# Altium schematic sheet PART6_Step_Up_PSU.SchDoc
size A4
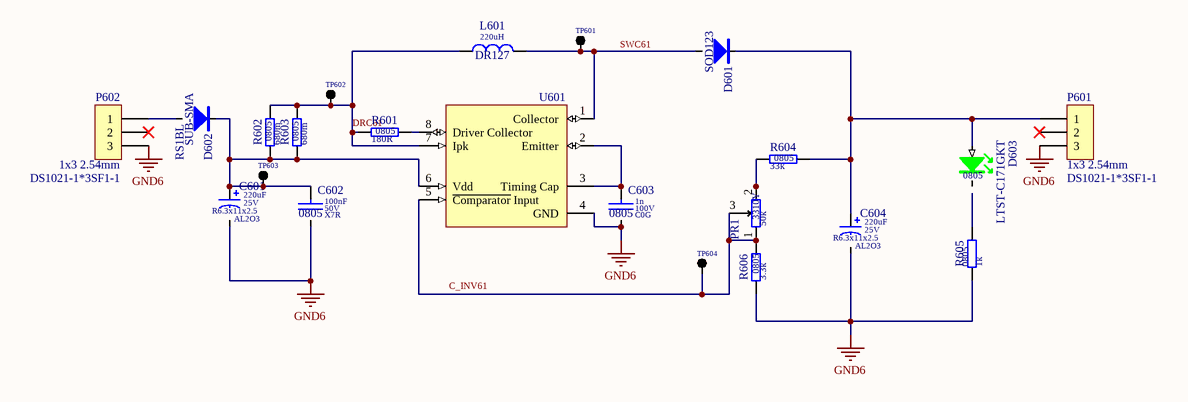
[diagram p0: PART6_Step_Up_PSU.SchDoc]

## Parts
C601  value 220uF  Dielectric: AL2O3  SCH_Footprint: R6.3x11x2.5  Voltage: 25V  [C_R6.3x11x2.5]  (hidden comment: Electrolytic Capacitor)
C602  value 100nF  Dielectric: X7R  Voltage: 50V  SCH_Footprint: 0805  [C_0805_2012]  (hidden comment: Ceramic X7R)
C603  value 1n  Dielectric: C0G  Voltage: 100V  SCH_Footprint: 0805  [C_0805_2012]  (hidden comment: Ceramic C0G)
C604  value 220uF  Dielectric: AL2O3  SCH_Footprint: R6.3x11x2.5  Voltage: 25V  [C_R6.3x11x2.5]  (hidden comment: Electrolytic Capacitor)
D601  1N5819HW  [SOD123]  (value not drawn)
D602  value RS1BL  [SUB-SMA]  (hidden comment: RS1BL fast rectifier)
D603  value LTST-C171GKT  SCH_Footprint: 0805  [OL_0805_2012]  (hidden comment: Green led)
L601  value 220uH  SCH_Footprint: DR127  [L_DR127]  (hidden comment: Inductor)
P601  value DS1021-1*3SF1-1  SCH_Footprint: 1x3 2.54mm  [P_HEADER_1x3_2.54]  (hidden comment: Goldpin)
P602  value DS1021-1*3SF1-1  SCH_Footprint: 1x3 2.54mm  [P_HEADER_1x3_2.54]  (hidden comment: Goldpin)
PR1  value 50k  [3310Y]  (hidden comment: Resistor)
R601  value 180R  SCH_Footprint: 0805  [R_0805_2012]  (hidden comment: Resistor)
R602  value 680m  SCH_Footprint: 0805  [R_0805_2012]  (hidden comment: Resistor)
R603  value 680m  SCH_Footprint: 0805  [R_0805_2012]  (hidden comment: Resistor)
R604  value 33k  SCH_Footprint: 0805  [R_0805_2012]  (hidden comment: Resistor)
R605  value 1k  SCH_Footprint: 0805  [R_0805_2012]  (hidden comment: Resistor)
R606  value 3.3k  SCH_Footprint: 0805  [R_0805_2012]  (hidden comment: Resistor)
TP601  Single pin  [TP_1PIN]  (value not drawn)
TP602  Single pin  [TP_1PIN]  (value not drawn)
TP603  Single pin  [TP_1PIN]  (value not drawn)
TP604  Single pin  [TP_1PIN]  (value not drawn)
U601  1.5-A Peak Boost/Buck/Inverting Switching Regulators  [SOP8_SO8_SOIC8_4X5X18]  (value not drawn)

## Nets
GND6: C601.2 C602.2 C603.2 C604.2 P601.3 P602.3 R605.1 R606.1 U601.4(GND)
DRC61: L601.1 R601.1 R602.2 R603.2 TP602.1(TP) U601.7(Ipk)
SWC61: D601.2 L601.2 TP601.1(TP) U601.1(Collector)
NetC601_1: C601.1 C602.1 D602.1 R602.1 R603.1 TP603.1(TP) U601.6(Vdd)
NetC603_1: C603.1 U601.2(Emitter) U601.3(Timing_Cap)
NetC604_1: C604.1 D601.1 D603.2(A) P601.1 R604.2
NetD602_2: D602.2 P602.1
NetPR1_1: PR1.1 PR1.3 R606.2 TP604.1(TP) U601.5(~{Comparator}_Input)
NetPR1_2: PR1.2 R604.1
NetR601_2: R601.2 U601.8(Driver_Collector)

Not connected (* = marked no-connect by the designer): D603 1(K); P601 2*; P602 2*; R605 2

## Notes on the sheet
- Labels drawn without touching a wire or pin: C_INV61

## Library data of the parts
C601 C604 = CE_220uF_25V_6.3x11x2.5_LESR_20: Polarized Capacitor; Manufacturer: Samxon; Manufacturer Part Number: GF 220U/25V; Tolerance (%): 20; Part Number: CE_220uF_25V_6.3x11x2.5_LESR_20; HelpURL: http://www.tme.eu/pl/Document/9fe41abe6e7b7973ea4089f212d099cc/E-GF_series.pdf; Supplier 1: TME; Supplier Part Number 1: GF220/25; Supplier 2: RS Components; Supplier 3: Farnell; Supplier 4: Mouser; Supplier 5: Digi-Key
C602 = C_100nF_50V_X7R_0805_10: Capacitor; Manufacturer: AVX; Manufacturer Part Number: 08055C104K4T2A; Tolerance (%): 10; Part Number: C_100nF_50V_X7R_0805_10; HelpURL: http://www.tme.eu/pl/Document/943bdb20b23b898c4d4b2ec4eca4f2b6/cauto.pdf; Supplier 1: TME; Supplier Part Number 1: 08055C104K4T2A; Supplier 2: RS Components; Supplier 3: Farnell; Supplier 4: Mouser; Supplier 5: Digi-Key
C603 = C_1nF_100V_C0G_0805_5: Capacitor; Manufacturer: Walsin; Manufacturer Part Number: 0805N102J101CT; Tolerance (%): 5; Part Number: C_1nF_100V_C0G_0805_5; HelpURL: https://datasheet.octopart.com/0805N102J101CT-Walsin-Technologies-datasheet-48038160.pdf; Supplier 1: TME; Supplier Part Number 1: 0805N102J101CT; Supplier 2: RS Components; Supplier 3: Farnell; Supplier Part Number 3: 2497011; Supplier 4: Mouser; Supplier Part Number 4: 791-0805N102J101CT; Supplier 5: Digi-Key
D601 = D_1N5819HW_1A_40V_SOD123: Voltage: 40V; Current: 1A; SCH_Footprint: SOD123; Part Number: D_1N5819HW_1A_40V_SOD123; Supplier 1: TME; Supplier 2: RS Components; Supplier 3: Farnell; Supplier 4: Mouser; Supplier 5: Digi-Key
D602 = D_RS1BL_100V_1A_SUB-SMA: Manufacturer: Taiwan Semiconductor; Voltage: 100V; Current: 1A; SCH_Footprint: SUB-SMA; Part Number: D_RS1BL_100V_1A_SUB-SMA; HelpURL: http://www.mouser.com/ds/2/395/RS1AL%20SERIES_K14-523620.pdf; Manufacturer Part Number: RS1BL; Supplier 1: TME; Supplier 2: RS Components; Supplier 3: Farnell; Supplier 4: Mouser; Supplier 5: Digi-Key
D603 = OL_G_0805_0C006_LTST-C171GKT: LED GREEN; Manufacturer: Lite-On; Part Number: OL_G_0805_0C006_LTST-C171GKT; HelpURL: http://datasheet.octopart.com/LTST-C171GKT-Lite-On-datasheet-158474.pdf; Manufacturer Part Number: LTST-C171GKT; Supplier 1: TME; Supplier Part Number 1: LTST-C171GKT; Supplier 2: RS Components; Supplier Part Number 2: 6920935; Supplier 3: Farnell; Supplier 4: Mouser; Supplier Part Number 4: 859-LTST-C171GKT; Supplier 5: Digi-Key; Supplier Part Number 5: 160-1423-1-ND
L601 = L_220uH_1.29A_DR127: Induction; Manufacturer: Eaton; Manufacturer Part Number: DR127-221-R; Current: 1.29A; Resistance: 376mR; Part Number: L_220uH_1.29A_DR127; HelpURL: https://datasheet.octopart.com/DR127-221-R-Eaton-datasheet-552538.pdf; Supplier 1: TME; Supplier 2: RS Components; Supplier Part Number 2: 7701028; Supplier 3: Farnell; Supplier Part Number 3: 2369123; Supplier 4: Mouser; Supplier Part Number 4: 704-DR127-221-R; Supplier 5: Digi-Key; Supplier Part Number 5: 513-1045-1-ND
P601 P602 = P_HEADER_1x3_2.54: Pin Header; Manufacturer: Connfly; Part Number: P_HEADER_1x3_2.54; Component Type: Standard; HelpURL: http://www.tme.eu/en/Document/cc301e58a5da78cb543a94b5a5b7f06a/DS1021.pdf; Manufacturer Part Number: DS1021-1*3SF1-1; Supplier 1: TME; Supplier Part Number 1: ZL201-03G; Supplier 2: RS Components; Supplier 3: Farnell; Supplier 4: Mouser; Supplier 5: Digi-Key
PR1 = R_50k_3310Y_20: Manufacturer: Bourns; Manufacturer Part Number: 3310Y-001-503L; Voltage: 50V; Power: 250mW; Tolerance: 20%; SCH_Footprint: 3310Y; Part Number: R_50k_3310Y_20; HelpURL: https://docs.rs-online.com/4641/0900766b8069b9f0.pdf; Supplier 1: TME; Supplier Part Number 1: 3310Y-001-503L; Supplier 2: RS Components; Supplier Part Number 2: 522-0697; Supplier 3: Farnell; Supplier Part Number 3: 9354000; Supplier 4: Mouser; Supplier 5: Digi-Key; Supplier Part Number 5: 3310Y-001-503L-ND
R601 = R_180R_0805_1: Manufacturer: Royalohm; Manufacturer Part Number: 0805S8F1800T5E; Voltage: 150V; Power: 125mW; Tolerance: 1%; Part Number: R_180R_0805_1; HelpURL: https://www.tme.eu/pl/Document/b315665a56acbc42df513c99b390ad98/ROYALOHM-THICKFILM.pdf; Supplier 1: TME; Supplier Part Number 1: SMD0805-180R-1%; Supplier 2: RS Components; Supplier 3: Farnell; Supplier 4: Mouser; Supplier 5: Digi-Key
R602 R603 = R_680m_0805_5: Manufacturer: Viking; Manufacturer Part Number: CS05JTFVR680; Voltage: 100V; Power: 250mW; Tolerance: 5%; Part Number: R_680m_0805_5; HelpURL: https://datasheet.octopart.com/CS05JTFVR680-Viking-datasheet-81455976.pdf; Supplier 1: TME; Supplier Part Number 1: CS0805-0R68-5%-HP; Supplier 2: RS Components; Supplier 3: Farnell; Supplier 4: Mouser; Supplier 5: Digi-Key
R604 = R_33k_0805_1: Manufacturer: Royalohm; Manufacturer Part Number: HP05W3F3302T5E; Voltage: 150V; Power: 300mW; Tolerance: 1%; Part Number: R_33k_0805_1; HelpURL: https://www.tme.eu/pl/Document/fa390a0a31e891a154d3713216995c6e/HighPowerHP.pdf; Supplier 1: TME; Supplier Part Number 1: HP05-33K1%; Supplier 2: RS Components; Supplier 3: Farnell; Supplier 4: Mouser; Supplier 5: Digi-Key
R605 = R_1k_0805_1: Manufacturer: Royalohm; Manufacturer Part Number: HP05W3F1001T5E; Voltage: 150V; Power: 300mW; Tolerance: 1%; Part Number: R_1k_0805_1; HelpURL: https://www.tme.eu/pl/Document/63d5a2fbb689d2d511047d7cc8640cd8/chip_resistor_hp.pdf; Supplier 1: TME; Supplier Part Number 1: HP05-1K1%; Supplier 2: RS Components; Supplier 3: Farnell; Supplier 4: Mouser; Supplier 5: Digi-Key
R606 = R_3.3k_0805_1: Manufacturer: Royalohm; Manufacturer Part Number: HP05W3F3301T5E; Voltage: 150V; Power: 300mW; Tolerance: 1%; Part Number: R_3.3k_0805_1; HelpURL: https://www.tme.eu/pl/Document/fa390a0a31e891a154d3713216995c6e/HighPowerHP.pdf; Supplier 1: TME; Supplier Part Number 1: HP05-3K31%; Supplier 2: RS Components; Supplier 3: Farnell; Supplier 4: Mouser; Supplier Part Number 4: 603-RC0805FR-073K3L; Supplier 5: Digi-Key; Supplier Part Number 5: 311-3.30KCRCT-ND
TP601-TP604 = TP_1PIN: Testpoint; SCH_Footprint: Single; Part Number: TP_1PIN; Component Type: Standard; Supplier 1: TME; Supplier 2: RS Components; Supplier 3: Farnell; Supplier 4: Mouser; Supplier 5: Digi-Key
U601 = U_MC34063AD: Manufacturer: Texas Instruments; SCH_Footprint: SOIC8; Value: MC34063AD; Part Number: U_MC34063AD; HelpURL: https://www.ti.com/lit/ds/symlink/mc34063a.pdf?ts=1594733387223; Manufacturer Part Number: MC34063AD; Supplier 1: TME; Supplier 2: RS Components; Supplier Part Number 2: 661-8436; Supplier 3: Farnell; Supplier Part Number 3: 3007277; Supplier 4: Mouser; Supplier Part Number 4: 595-MC34063AD; Supplier 5: Digi-Key